# Altium project Fri3D_2020_00.PrjPcb
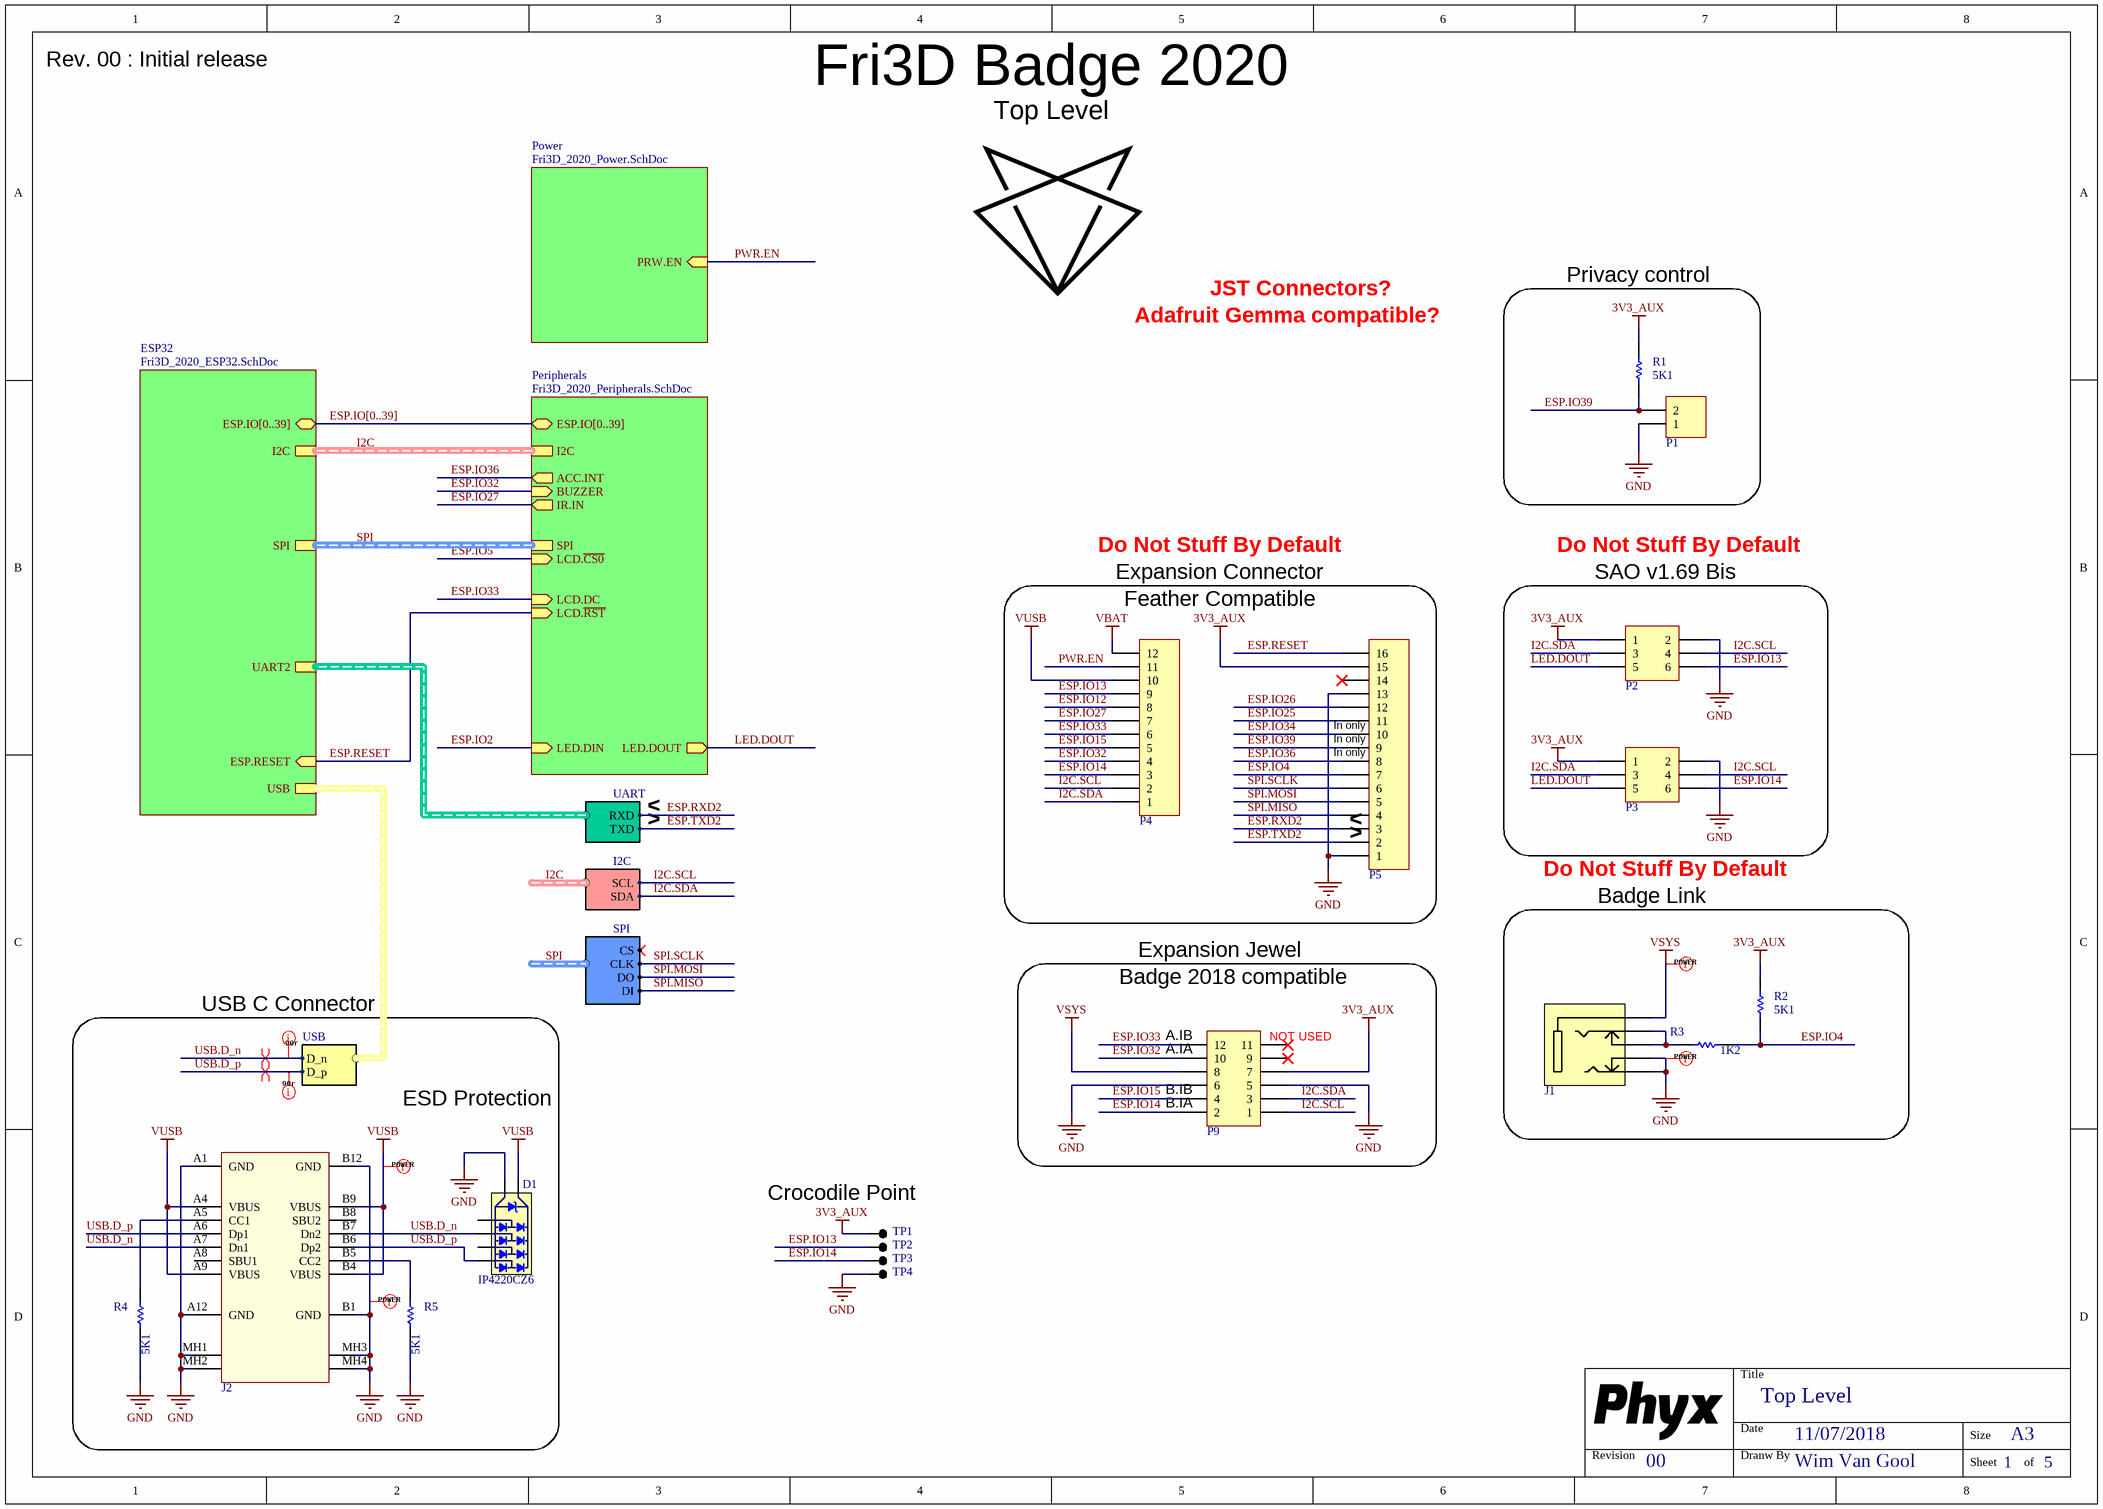
[diagram p0: Fri3D_2020_00.SchDoc]
PCB_ENGINEER: WimVG; PCB_REV: 00; PCB_TITLE: Fri3D Badge 2020
4 sheets, 115 parts. Net scope: hierarchical (ports join the sheet entries above them; power ports are global).
Board file: Fri3D_2020_00.PcbDoc
Sheets:
  Fri3D_2020_00.SchDoc
    Peripherals = Fri3D_2020_Peripherals.SchDoc
    Power = Fri3D_2020_Power.SchDoc
    ESP32 = Fri3D_2020_ESP32.SchDoc

## Sheet Fri3D_2020_00.SchDoc: Top Level
size A3; Date: 11/07/2018; DrawnBy: Wim Van Gool; DocumentNumber: 1; Revision: 00; SheetNumber: 1; SheetTotal: 5

### Parts
D1  value IP4220CZ6  [NXP_SOT457]  (hidden comment: TVS Diode Dual USB)
J1  3.5mm jack, dual switch, black, 3 contacts  [CUI_SJ1-3525NG]  (value not drawn)
J2  USB 2.0 C Reversible Receptacle Horizontal  [HRO_TYPE-C-31-M-12]  (value not drawn)
P1  Easy to solder connection  [SOLDER_SW_V_1MM]  (value not drawn)
P2  Receptacle 3x2  [RCPT2X3]  (value not drawn)
P3  Receptacle 3x2  [RCPT2X3]  (value not drawn)
P4  Header 12  [HDR1X12]  (value not drawn)
P5  Header 16  [HDR1X16]  (value not drawn)
P9  Receptacle 6x2 SMD low profile  [WE_610312243021_POST]  (value not drawn)
R1  value 5K1  [R0603_N]  (hidden comment: RESISTOR)
R2  value 5K1  [R0603_N]  (hidden comment: RESISTOR)
R3  value 1K2  [R0603_N]  (hidden comment: RESISTOR)
R4  value 5K1  [R0603_N]  (hidden comment: RESISTOR)
R5  value 5K1  [R0603_N]  (hidden comment: RESISTOR)
TP1  TEST_PAD  [TP_0.8mm]  (value not drawn)
TP2  TEST_PAD  [TP_0.8mm]  (value not drawn)
TP3  TEST_PAD  [TP_0.8mm]  (value not drawn)
TP4  TEST_PAD  [TP_0.8mm]  (value not drawn)

### Blocks framed on the sheet
Privacy control: P1 R1
SAO v1.69 Bis: P2 P3
Badge Link: J1 R2 R3

### Sub-sheets
ESP32 = Fri3D_2020_ESP32.SchDoc: I2C (harness I2C), USB (harness USB), SPI (harness SPI), UART2 (harness UART), ESP.RESET (in), ESP.IO[0..39] (bidir)
Peripherals = Fri3D_2020_Peripherals.SchDoc: I2C (harness I2C), ACC.INT (out), BUZZER (in), LED.DIN (in), LED.DOUT (out), SPI (harness SPI), IR.IN (out), LCD.DC (in), LCD.~{RST} (in), LCD.~{CS0} (in), ESP.IO[0..39] (bidir)
Power = Fri3D_2020_Power.SchDoc: PRW.EN (in)

### Harnesses
USB: D_p, D_n
I2C: SDA, SCL
SPI: CS, CLK, DO, DI
UART: TXD, RXD

### Nets
3V3_AUX: P2.1 P3.1 P5.15 P9.7 R1.1 R2.1 TP1.1
GND: D1.2(GND) J1.2(Tip) J1.4 J2.A1(GND) J2.A12(GND) J2.B1(GND) J2.B12(GND) J2.MH1(Tab) J2.MH2(Tab) J2.MH3(Tab) J2.MH4(Tab) P1.1 P2.2 P3.2 P5.1 P5.13 P9.5 P9.6 R4.2 R5.2 TP4.1
VBAT: P4.12
VSYS: J1.1(Sleeve) P9.8
VUSB: D1.5(VBus) J2.A4(VBUS) J2.A9(VBUS) J2.B4(VBUS) J2.B9(VBUS) P4.10
ESP.IO4: P5.7 R2.2 R3.1
ESP.IO12: P4.8
ESP.IO13: P2.6 P4.9 TP2.1
ESP.IO14: P3.6 P4.3 P9.2 TP3.1
ESP.IO15: P4.5 P9.4
ESP.IO25: P5.11
ESP.IO26: P5.12
ESP.IO27: P4.7 ; sheet Peripherals/IR.IN
ESP.IO32: P4.4 P9.10 ; sheet Peripherals/BUZZER  [project net BUZZER]
ESP.IO33: P4.6 P9.12 ; sheet Peripherals/LCD.DC
ESP.IO34: P5.10
ESP.IO36: P5.8 ; sheet Peripherals/ACC.INT  [project net ACC.INT1]
ESP.IO39: P1.2 P5.9 R1.2
ESP.RESET: P5.16 ; sheet Peripherals/LCD.~{RST}, sheet ESP32/ESP.RESET
ESP.RXD2: P5.3 ; sheet ESP32/UART2.RXD  [project net ESP.IO16]
ESP.TXD2: P5.2 ; sheet ESP32/UART2.TXD  [project net ESP.IO17]
I2C.SCL: P2.4 P3.4 P4.2 P9.1 ; sheet Peripherals/I2C.SCL
I2C.SDA: P2.3 P3.3 P4.1 P9.3 ; sheet Peripherals/I2C.SDA
LED.DOUT: P2.5 P3.5 ; sheet Peripherals/LED.DOUT
PWR.EN: P4.11 ; sheet Power/PRW.EN
SPI.MISO: P5.4 ; sheet Peripherals/SPI.DI  [project net SPI.DI]
SPI.MOSI: P5.5 ; sheet Peripherals/SPI.DO  [project net SPI.DO]
SPI.SCLK: P5.6 ; sheet Peripherals/SPI.CLK  [project net SPI.CLK]
USB.D_n: D1.1 J2.A7(Dn1) J2.B7(Dn2) ; sheet ESP32/USB.D_n
USB.D_p: D1.6 J2.A6(Dp1) J2.B6(Dp2) ; sheet ESP32/USB.D_p
NetJ1_3: J1.3(Ring) J1.5 R3.2
NetJ2_A5: J2.A5(CC1) R4.1
NetJ2_B5: J2.B5(CC2) R5.1

Not connected (* = marked no-connect by the designer): D1 3 4; J2 A8(SBU1) B8(SBU2); P5 14*; P9 9* 11*

### Buses and harness runs
bus ESP.IO[0..39] = sheet ESP32/ESP.IO[0..39] = sheet Peripherals/ESP.IO[0..39]
harness I2C = sheet ESP32/I2C = sheet Peripherals/I2C
harness SPI = sheet ESP32/SPI = sheet Peripherals/SPI

### Layout directives
net class 90r: USB.D_n, USB.D_p
differential pair: USB.D_n, USB.D_p
net class POWER: GND, VSYS, VUSB

### Notes on the sheet
- Rev. 00 : Initial release
- JST Connectors?
- Adafruit Gemma compatible?
- Expansion Connector
- Do Not Stuff By Default
- Feather Compatible
- (near P5) In only
- >
- <
- (near P5) >
- (near P5) <
- Expansion Jewel
- Badge 2018 compatible
- USB C Connector
- (near P9) A.IB
- (near P9) A.IA
- (near P9) NOT USED
- ESD Protection
- (near P9) B.IB
- (near P9) B.IA
- Crocodile Point
- Title
- Revision
- Date
- Dranw By
- Size
- A3
- Sheet
- of

### Library data of the parts
D1 = TVS # IP4220CZ6 Dual USB: =Description; Supplier 1: Farnell; Supplier Part Number 1: 2143248
J1 = AUDIO JACK 3.5 3c SJ1-3525NG: =Description; Value: SJ1-3525NG; Supplier 1: Digi-key; Supplier Part Number 1: CP1-3525NG-ND
J2 = USB # C 2.0 RCPT TYPE-C-31-M-12: Value: TYPE-C-31-M-12; Supplier 1: China; Supplier Part Number 1: HRO TYPE-C-31-M-12; Supplier 2: LCSC; Supplier Part Number 2: C165948; Supplier 3: LCSC ALT; Supplier Part Number 3: C167321 / C319148
P1 = SOLDER SW V 1MM: Value: NO BOM
P2 P3 = Receptacle 2.54mm dual row 6way
P4 = Pin Header 2.54mm 12way
P5 = Pin Header 2.54mm 16way
P9 = Receptacle # 2.54mm dual row 12way 610312243021: Value: 610312243021; Supplier 1: Wurth; Supplier Part Number 1: 610312243021
R1 R2 R4 R5 = RES # 5K1 0603: Supplier 1: Farnell; Supplier Part Number 1: 2845922
R3 = RES # 1K2 0603
TP1-TP4 = TP # 0.8mm: Value: NO BOM

## Sheet Fri3D_2020_Peripherals.SchDoc: Peripherals
size A3; Date: 11/07/2018; DrawnBy: Wim Van Gool; DocumentNumber: 4; Revision: 00; SheetNumber: 4; SheetTotal: 5
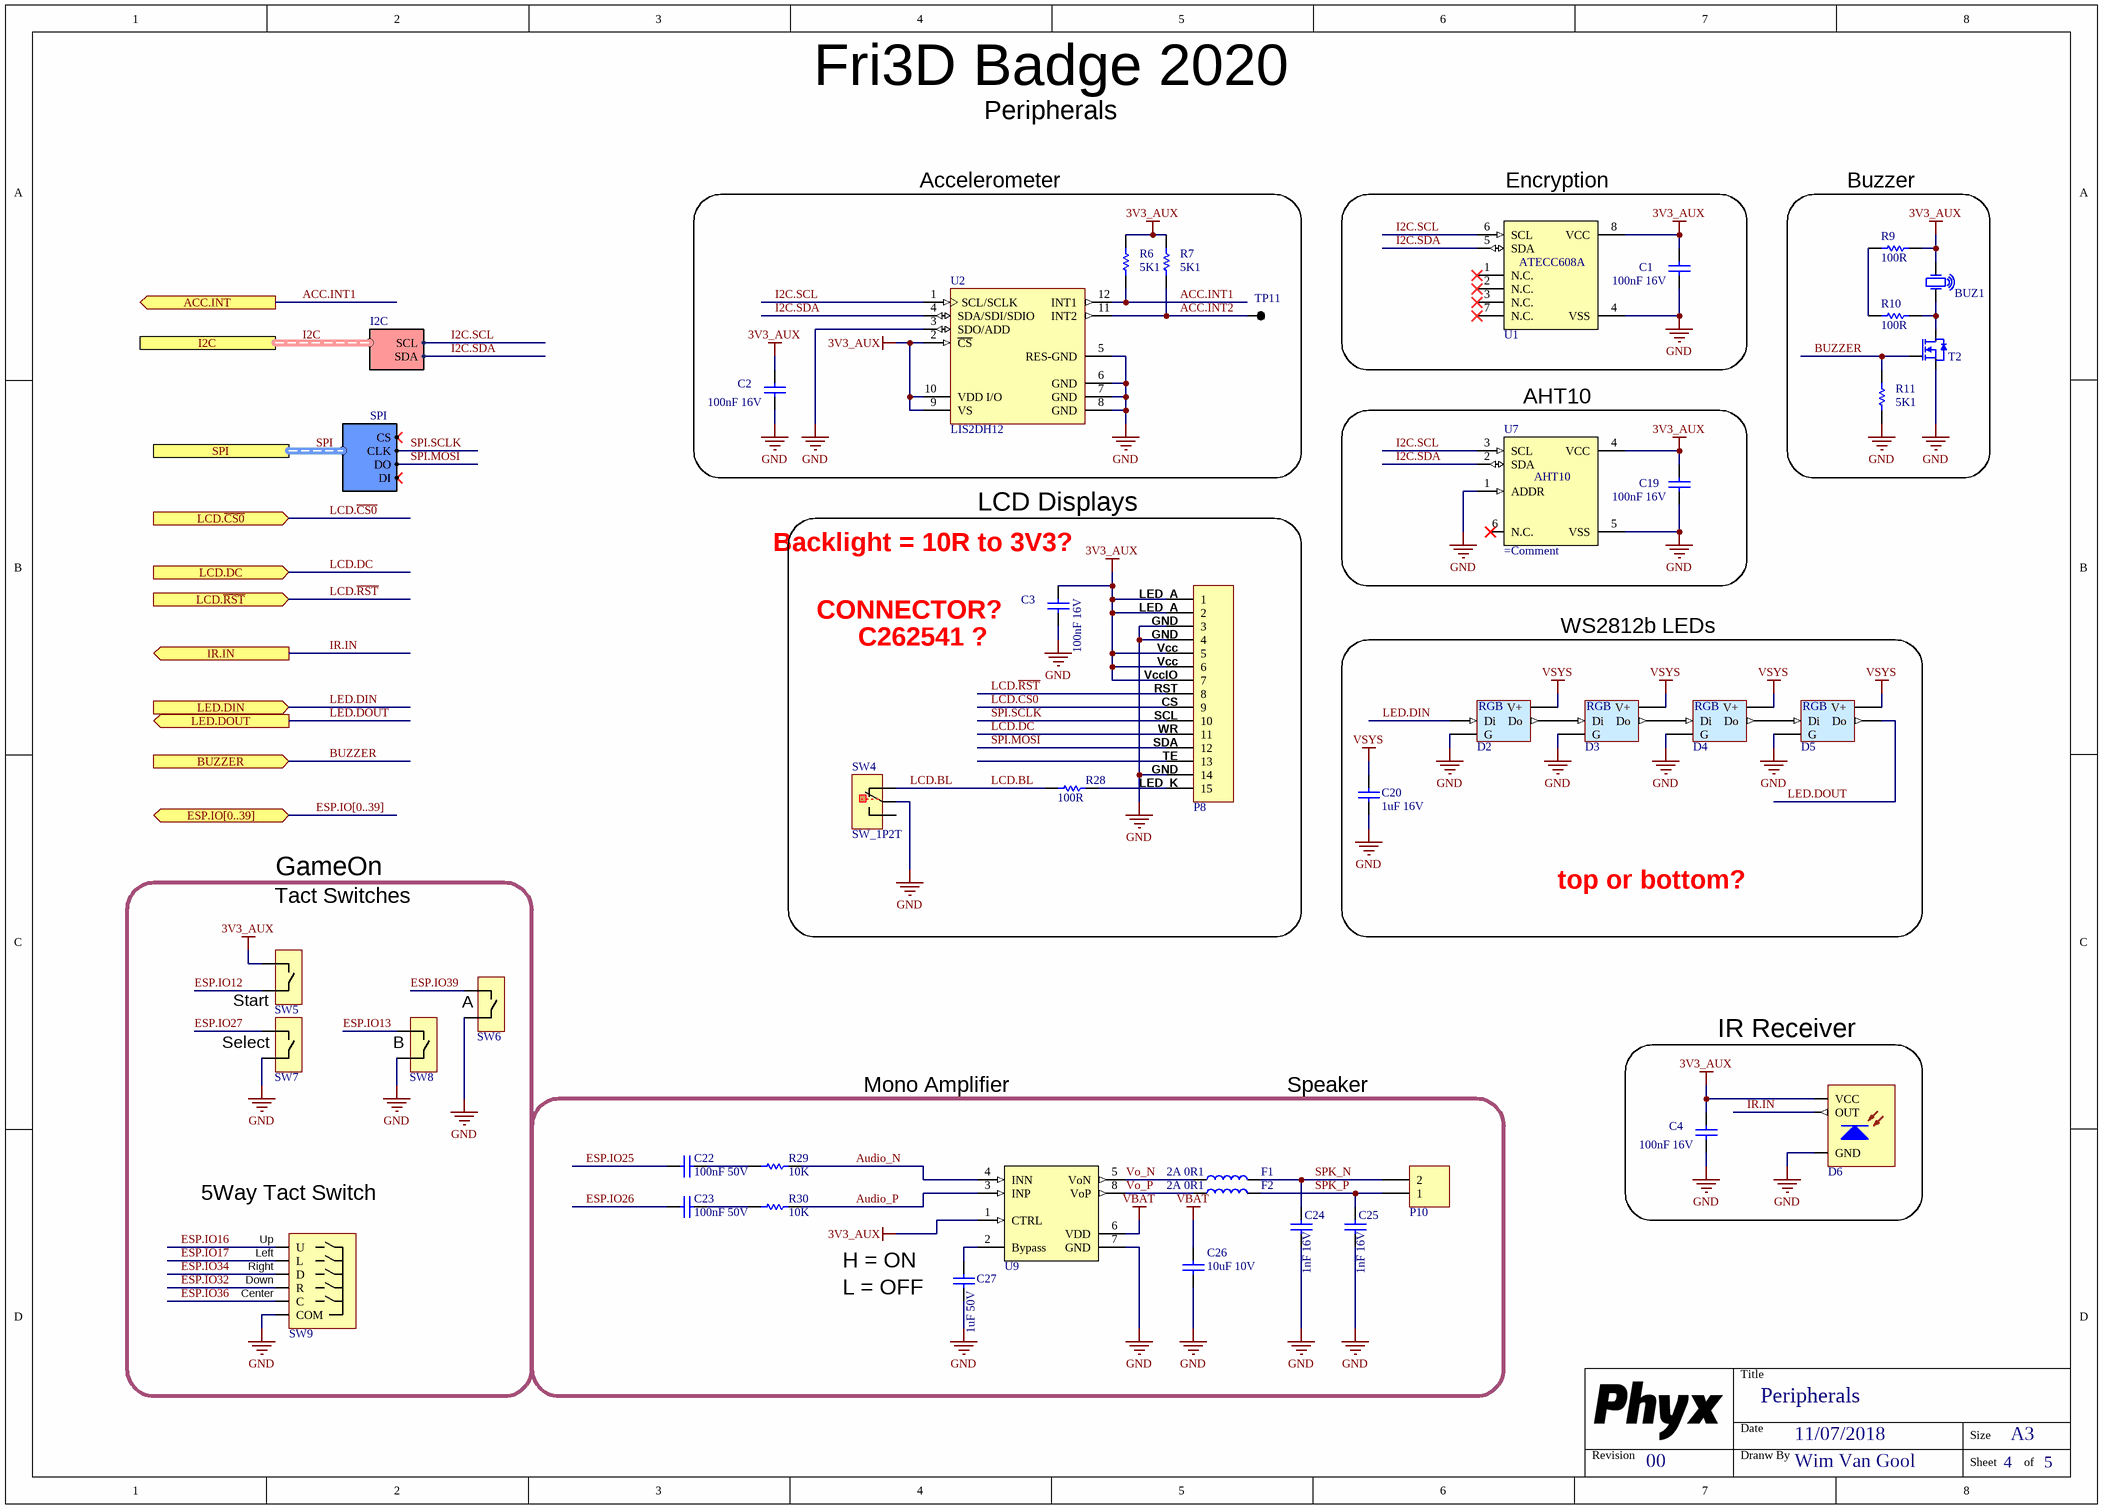
[diagram p1: Fri3D_2020_Peripherals.SchDoc]

### Parts
BUZ1  12x12x3mm Piezo Buzzer Transducer 81dB  [CUI_CMT-1203-SMT]  (value not drawn)
C1  value 100nF 16V  [C0603_N]
C2  value 100nF 16V  [C0603_N]
C3  value 100nF 16V  [C0603_N]
C4  value 100nF 16V  [C0603_N]
C19  value 100nF 16V  [C0603_N]
C20  value 1uF 16V  [C0603_N]  (hidden comment: CAP_CERAMIC)
C22  value 100nF 50V  [C0603_N]  (hidden comment: CAP_CERAMIC)
C23  value 100nF 50V  [C0603_N]  (hidden comment: CAP_CERAMIC)
C24  value 1nF 16V  [C0603_N]  (hidden comment: CAP_CERAMIC)
C25  value 1nF 16V  [C0603_N]  (hidden comment: CAP_CERAMIC)
C26  value 10uF 10V  [C0805_N]  (hidden comment: CAP_CERAMIC)
C27  value 1uF 50V  [C0603_N]  (hidden comment: CAP_CERAMIC)
D2  WS2812 based digital RGB LED 5050 Black package  [LED_5050_WS2812B_BLACK]  (value not drawn)
D3  WS2812 based digital RGB LED 5050 Black package  [LED_5050_WS2812B_BLACK]  (value not drawn)
D4  WS2812 based digital RGB LED 5050 Black package  [LED_5050_WS2812B_BLACK]  (value not drawn)
D5  WS2812 based digital RGB LED 5050 Black package  [LED_5050_WS2812B_BLACK]  (value not drawn)
D6  IRM-3638N3F14 Infrared Receiver 38 kHz 45° 2.7-5.5V  [VIS_TSOP381x_BENT]  (value not drawn)
F1  value 2A 0R1  [L0805]  (hidden comment: FERRITE)
F2  value 2A 0R1  [L0805]  (hidden comment: FERRITE)
P8  Bottom contact FPC 0.3mm pitch 15 contacts  [FPC_AFE03-S15FMA-1H]  (value not drawn)
P10  Header 2  [HDR1X2]  (value not drawn)
R6  value 5K1  [R0603_N]  (hidden comment: RESISTOR)
R7  value 5K1  [R0603_N]  (hidden comment: RESISTOR)
R9  value 100R  [R0603_N]  (hidden comment: RESISTOR)
R10  value 100R  [R0603_N]  (hidden comment: RESISTOR)
R11  value 5K1  [R0603_N]  (hidden comment: RESISTOR)
R28  value 100R  [R0603_N]  (hidden comment: RESISTOR)
R29  value 10K  [R0603_N]  (hidden comment: RESISTOR)
R30  value 10K  [R0603_N]  (hidden comment: RESISTOR)
SW4  SW_1P2T  [WE_450404015514]
SW5  Default TH TACT  [TACTSW]  (value not drawn)
SW6  Default TH TACT  [TACTSW]  (value not drawn)
SW7  Default TH TACT  [TACTSW]  (value not drawn)
SW8  Default TH TACT  [TACTSW]  (value not drawn)
SW9  5Way Tact switch  [TACTSW_5W_K1-1506DN-01]  (value not drawn)
T2  0.2A N-Ch MOSFET Vgs 3.2  [SOT23-3]  (value not drawn)
TP11  TEST_PAD  [TP_0.8mm]  (value not drawn)
U1  Encryption Authentication with 72b SN, SHA-256, AES-128  [SOIC_N_8]  (value not drawn)
U2  LIS2DH12  [STM_LGA12_2x2]
U7  (no value)  [AHT10]
U9  5W Class D mono amplifier inducter-less Differential input MSOP8  [MAX_uSOP8]  (value not drawn)

### Blocks framed on the sheet
Accelerometer: C2 R6 R7 TP11 U2
Encryption: C1 U1
Buzzer: BUZ1 R9-R11 T2
AHT10: C19 U7
top or bottom?: C20 D2-D5
GameOn: SW5-SW9
IR Receiver: C4 D6

### Ports
ACC.INT (out), BUZZER (in), ESP.IO[0..39] (bidir), I2C (harness I2C), IR.IN (out), LCD.DC (in), LCD.~{CS0} (in), LCD.~{RST} (in), LED.DIN (in), LED.DOUT (out), SPI (harness SPI)

### Harnesses
I2C: SDA, SCL
SPI: CS, CLK, DO, DI

### Nets
3V3_AUX: BUZ1.1(OSC1) C1.1 C2.1 C3.1 C4.1 C19.1 D6.3(VCC) P8.1 P8.2 P8.5 P8.6 P8.7 R6.1 R7.1 R9.1 SW5.1 U1.8(VCC) U2.2(~{CS}) U2.9(VS) U2.10(VDD_I/O) U7.4(VCC) U9.1(CTRL)
GND: C1.2 C2.2 C3.2 C4.2 C19.2 C20.2 C24.2 C25.2 C26.2 C27.2 D2.3(G) D3.3(G) D4.3(G) D5.3(G) D6.2(GND) P8.3 P8.4 P8.14 R11.2 SW4.2 SW6.2 SW7.2 SW8.2 SW9.4(COM) T2.2(S) U1.4(VSS) U2.3(SDO/ADD) U2.5(RES-GND) U2.6(GND) U2.7(GND) U2.8(GND) U7.1(ADDR) U7.5(VSS) U9.7(GND)
VBAT: C26.1 U9.6(VDD)
VSYS: C20.1 D2.1(V+) D3.1(V+) D4.1(V+) D5.1(V+)
ACC.INT1: R6.2 SW9.6(C) U2.12(INT1) ; port ACC.INT  [also labelled ESP.IO36]
ACC.INT2: R7.2 TP11.1 U2.11(INT2)
Audio_N: R29.2 U9.4(INN)
Audio_P: R30.2 U9.3(INP)
BUZZER: R11.1 SW9.5(R) T2.1(G) ; port BUZZER  [also labelled ESP.IO32]
ESP.IO12: SW5.2
ESP.IO13: SW8.1
ESP.IO16: SW9.1(U)
ESP.IO17: SW9.2(L)
ESP.IO25: C22.2
ESP.IO26: C23.2
ESP.IO27: D6.1(OUT) SW7.1 ; port IR.IN  [also labelled IR.IN]
ESP.IO34: SW9.3(D)
ESP.IO39: SW6.1
I2C.SCL: U1.6(SCL) U2.1(SCL/SCLK) U7.3(SCL) ; port I2C.SCL
I2C.SDA: U1.5(SDA) U2.4(SDA/SDI/SDIO) U7.2(SDA) ; port I2C.SDA
LCD.BL: R28.2 SW4.1
LCD.~{CS0}: P8.9 ; port LCD.~{CS0}  [project net ESP.IO5]
LCD.DC: P8.11 ; port LCD.DC  [project net ESP.IO33]
LCD.~{RST}: P8.8 ; port LCD.~{RST}  [project net ESP.RESET]
LED.DIN: D2.4(Di) ; port LED.DIN  [project net ESP.IO2]
LED.DOUT: D5.2(Do) ; port LED.DOUT
SPI.MOSI: P8.12 ; port SPI.DO  [project net SPI.DO]
SPI.SCLK: P8.10 ; port SPI.CLK  [project net SPI.CLK]
SPK_N: C24.1 F1.2 P10.2
SPK_P: C25.1 F2.2 P10.1
Vo_N: F1.1 U9.5(VoN)
Vo_P: F2.1 U9.8(VoP)
NetBUZ1_2: BUZ1.2(OSC2) R10.1 T2.3(D)
NetC22_1: C22.1 R29.1
NetC23_1: C23.1 R30.1
NetC27_1: C27.1 U9.2(Bypass)
NetD2_2: D2.2(Do) D3.4(Di)
NetD3_2: D3.2(Do) D4.4(Di)
NetD4_2: D4.2(Do) D5.4(Di)
NetP8_15: P8.15 R28.1
NetR9_2: R9.2 R10.2

Not connected (* = marked no-connect by the designer): P8 13; SW4 3; U1 1(N.C.)* 2(N.C.)* 3(N.C.)* 7(N.C.)*; U7 6(N.C.)*

### Buses and harness runs
bus ESP.IO[0..39] = port ESP.IO[0..39]
harness I2C = port I2C
harness SPI = port SPI

### Notes on the sheet
- LCD Displays
- (near C3) Backlight = 10R to 3V3?
- (near P8) LED_A
- CONNECTOR?
- C262541 ?
- (near P8) GND
- (near P8) Vcc
- WS2812b LEDs
- (near P8) VccIO
- (near P8) RST
- (near P8) CS
- (near P8) SCL
- (near P8) WR
- (near P8) SDA
- (near P8) TE
- (near P8) LED_K
- Tact Switches
- (near SW5) Start
- (near SW7) Select
- (near SW8) B
- (near SW6) A
- Mono Amplifier
- Speaker
- (near SW9) Up
- (near SW9) Left
- (near SW9) 5Way Tact Switch
- (near SW9) Right
- (near SW9) Down
- (near SW9) Center
- H = ON
- (near C27) L = OFF
- Title
- Revision
- Date
- Dranw By
- Size
- A3
- Sheet
- of
- (in symbol CRYPTO # ATECC608A I2C SOIC-8) ATECC608A
- (in symbol LED # RGB WS2812B-5050 BL) RGB

### Library data of the parts
BUZ1 = BUZ # CUI CMT-1203-SMT: Crystal Oscillator; Value: CMT-1203-SMT; Supplier 1: Digikey; Supplier Part Number 1: 102-2197-1-ND; Supplier 2: Aliexpress; Supplier Part Number 2: KLJ-1230
C1-C4 C19 = CAP # 100nF 16V 0603: Capacitor Ceramic
C20 = CAP # 1uF 16V 0603: Capacitor Ceramic; Supplier 1: Farnell; Supplier Part Number 1: 2320814
C22 C23 = CAP # 100nF 50V 0603: Capacitor Ceramic; Supplier 1: Farnell; Supplier Part Number 1: 1759122
C24 C25 = CAP # 1nF 16V 0603: Capacitor Ceramic
C26 = CAP # 10uF 10V 0805: Capacitor Ceramic; Supplier 1: Farnell; Supplier Part Number 1: 2320859
C27 = CAP # 1uF 50V 0603: Capacitor Ceramic; Supplier 1: Farnell; Supplier Part Number 1: 2112858
D2-D5 = LED # RGB WS2812B-5050 BL: =Description; Value: WS218B 5050 BL; Supplier 1: Aliexpress; Supplier Part Number 1: WS2812B Black 5050
D6 = PHO IR Rx RA: =Description; Value: IRM-3638N3F14; Supplier 1: LCSC; Supplier Part Number 1: C264262
F1 F2 = FER # 600R 2A 0805 0R10: Supplier 1: Farnell; Supplier Part Number 1: 1838838
P8 = FPC # 15 Bottom 0.3mm AFE03-S15FMA-1H: Value: AFE03-S15FMA-1H; Supplier 1: LCSC; Supplier Part Number 1: C262541
P10 = Pin Header 2.54mm 2way
R6 R7 R11 = RES # 5K1 0603: Supplier 1: Farnell; Supplier Part Number 1: 2845922
R9 R10 R28 = RES # 100R 0603
R29 R30 = RES # 10K 0603: Supplier 1: Farnell; Supplier Part Number 1: 2502397
SW4 = SW # 1P2T WS-SLSU mini slide 6,7 x 2,7 mm
SW5-SW8 = SW TACT
SW9 = SW TACT 5W K1-1506DN-01: Value: K1-1506DN-01; Supplier 1: LCSC; Supplier Part Number 1: C145911
T2 = BSS138 N-Ch MOSFET 0.2A 3.2Vgs 60Vds: Value: BSS138; Supplier 1: Farnell; Supplier Part Number 1: 2432717
TP11 = TP # 0.8mm: Value: NO BOM
U1 = CRYPTO # ATECC608A I2C SOIC-8: =Description; Value: ATECC608A-SSHDA-T; Supplier 1: Farnell; Supplier Part Number 1: 2920872; Supplier 2: Digi-key; Supplier Part Number 2: ATECC608A-SSHDA-TCT-ND; Supplier 3: Mouser; Supplier Part Number 3: 556-ATECC608ASSHDAT
U2 = ACCELERO # LIS2DH12: =Description
U7 = TMP HUM # AHT10: =Description
U9 = AMP # AUDIO NS4150B: =Description; Value: NS4150B; Supplier 1: LCSC; Supplier Part Number 1: C189961

## Sheet Fri3D_2020_Power.SchDoc: Power
size A3; Date: 11/07/2018; DrawnBy: Wim Van Gool; DocumentNumber: 5; Revision: 00; SheetNumber: 5; SheetTotal: 5
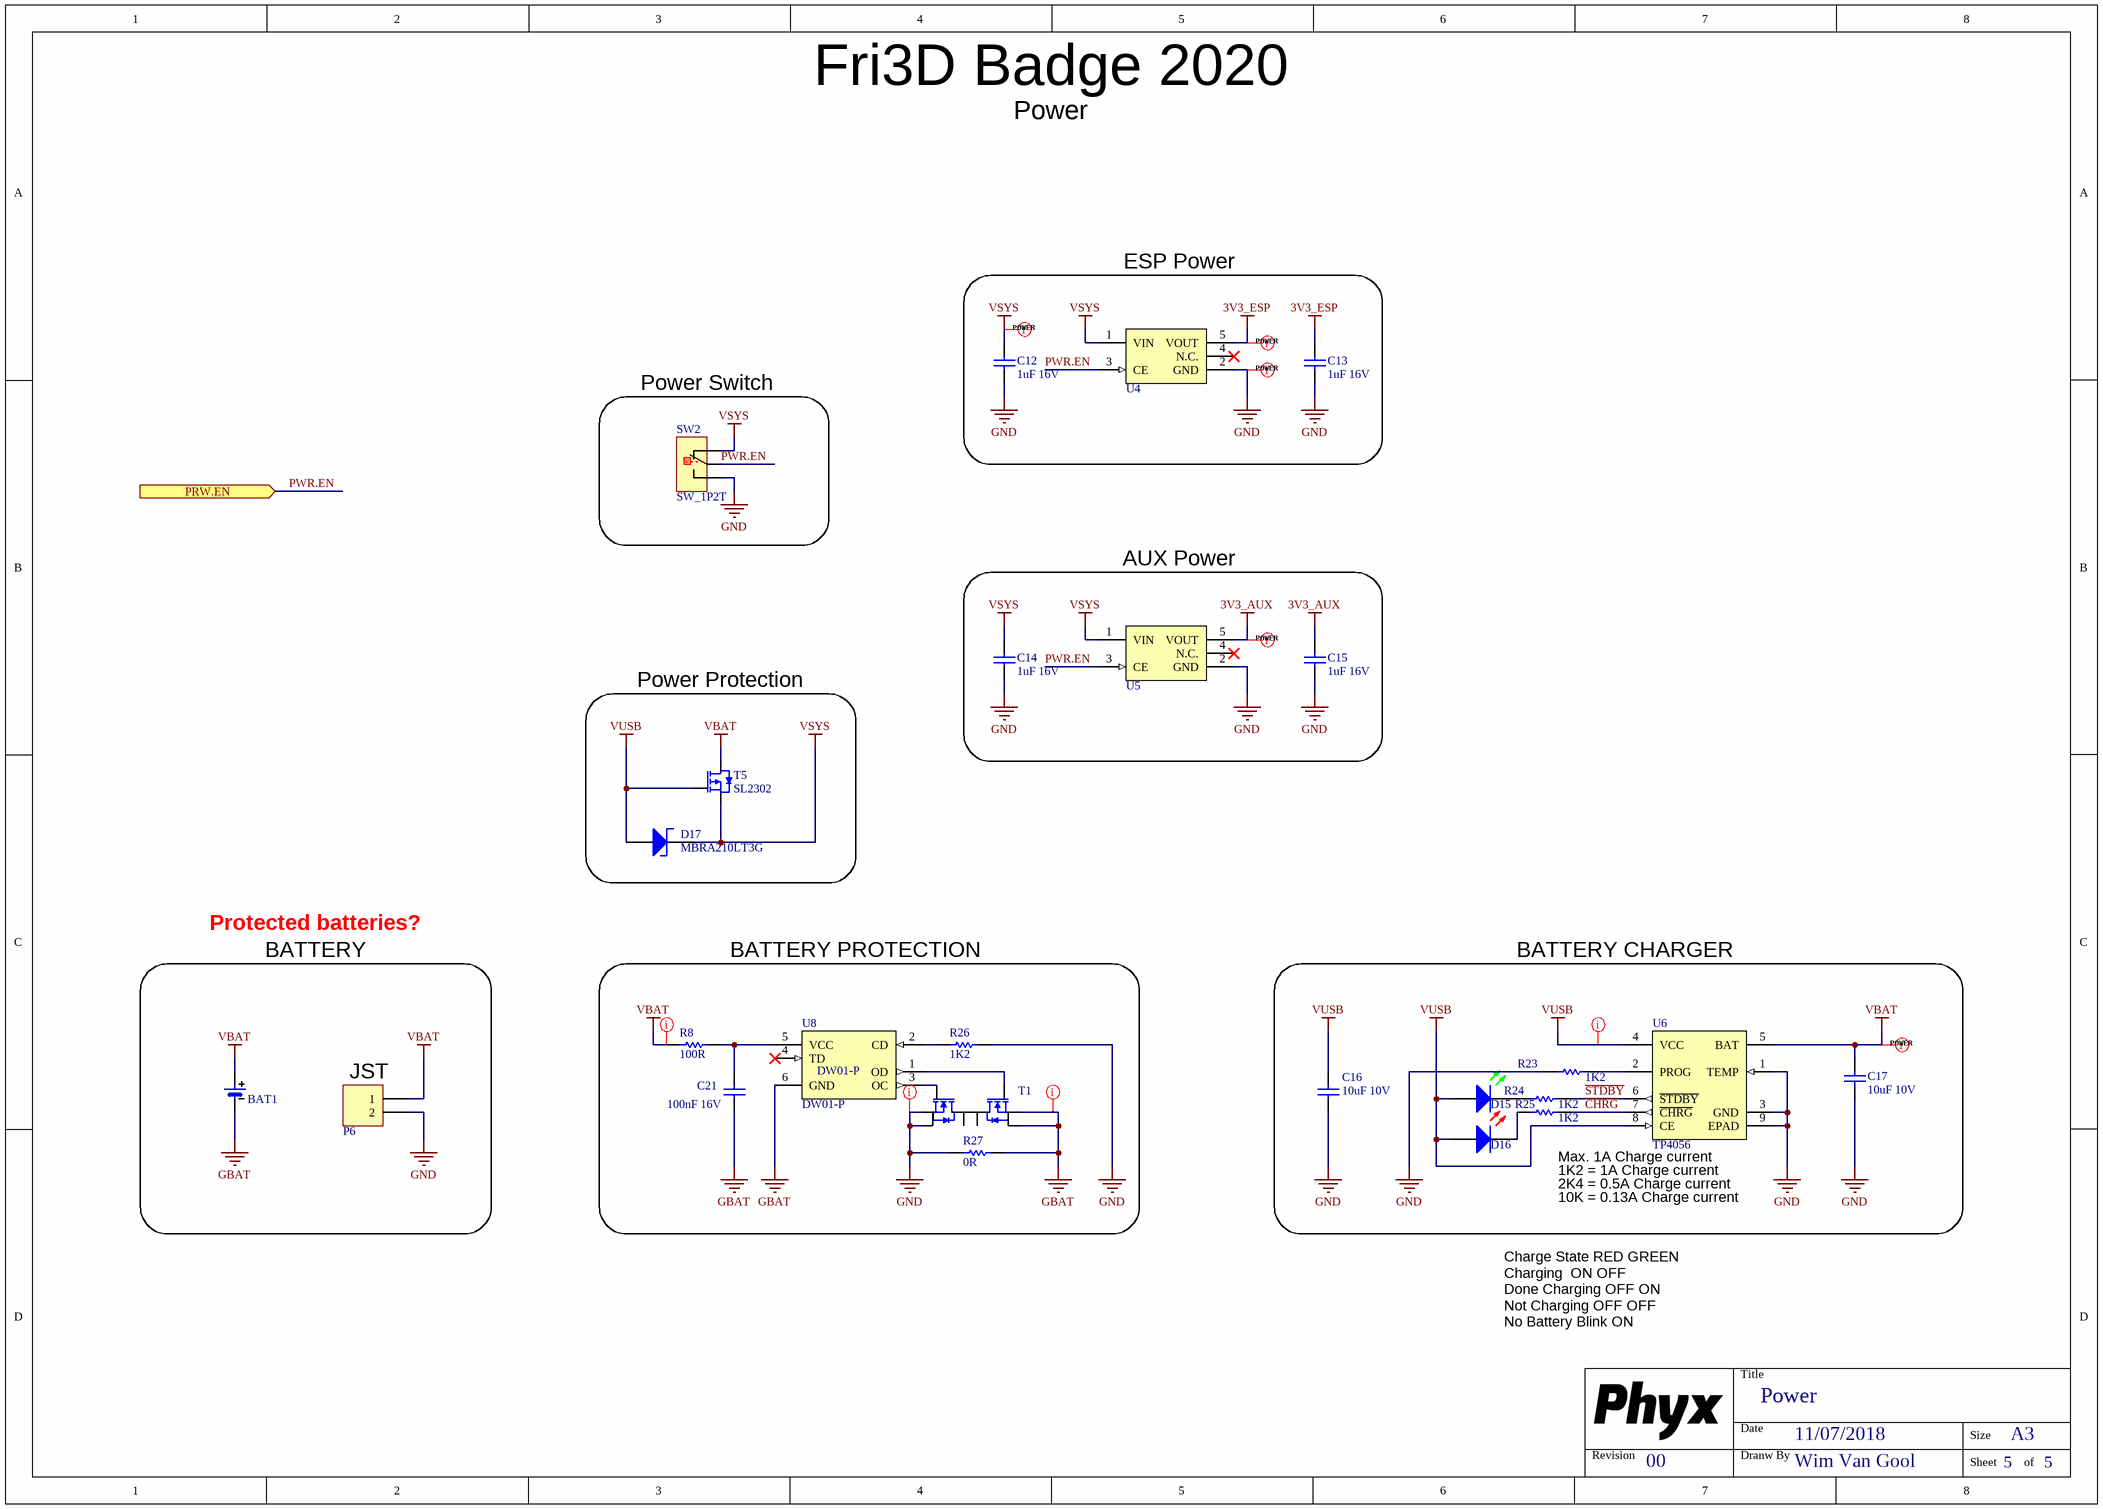
[diagram p2: Fri3D_2020_Power.SchDoc]

### Parts
BAT1  18650 Battery holder with spring  [BAT_18650_SPRING]  (value not drawn)
C12  value 1uF 16V  [C0603_N]  (hidden comment: CAP_CERAMIC)
C13  value 1uF 16V  [C0603_N]  (hidden comment: CAP_CERAMIC)
C14  value 1uF 16V  [C0603_N]  (hidden comment: CAP_CERAMIC)
C15  value 1uF 16V  [C0603_N]  (hidden comment: CAP_CERAMIC)
C16  value 10uF 10V  [C0805_N]  (hidden comment: CAP_CERAMIC)
C17  value 10uF 10V  [C0805_N]  (hidden comment: CAP_CERAMIC)
C21  value 100nF 16V  [C0603_N]
D15  Default 0805 Green LED  [LED_0805_GR]  (value not drawn)
D16  Default 0805 Red LED  [LED_0805_RD]  (value not drawn)
D17  MBRA210LT3G  [SMA_AC]
P6  Header 2.0mm Shrouded 2  [WE_620102131822]  (value not drawn)
R8  value 100R  [R0603_N]  (hidden comment: RESISTOR)
R23  value 1K2  [R0603_N]  (hidden comment: RESISTOR)
R24  value 1K2  [R0603_N]  (hidden comment: RESISTOR)
R25  value 1K2  [R0603_N]  (hidden comment: RESISTOR)
R26  value 1K2  [R0603_N]  (hidden comment: RESISTOR)
R27  value 0R  [R0603_N]
SW2  SW_1P2T  [WE_450404015514]
T1  Dual N-Ch MOSFET Common Drain  [TSSOP_8_65P]  (value not drawn)
T5  SL2302  [SOT23-3]
U4  3V3 LDO 700mA 50mV  [SOT23-5]  (value not drawn)
U5  3V3 LDO 700mA 50mV  [SOT23-5]  (value not drawn)
U6  value TP4056  [SOIC_N_8_TH]  (hidden comment: Single Cell LiIon charger max 1A)
U8  value DW01-P  [SOT23-6]  (hidden comment: DW01-P single cell lithium protection)

### Blocks framed on the sheet
ESP Power: C12 C13 U4
Power Switch: SW2
AUX Power: C14 C15 U5
Power Protection: D17 T5
BATTERY PROTECTION: C21 R8 R26 R27 T1 U8
BATTERY CHARGER: C16 C17 D15 D16 R23-R25 U6

### Ports
PRW.EN (in)

### Nets
3V3_AUX: C15.1 U5.5(VOUT)
3V3_ESP: C13.1 U4.5(VOUT)
GBAT: BAT1.2 C21.2 R27.1 T1.2(S1) T1.3(S1) U8.6(GND)
GND: C12.2 C13.2 C14.2 C15.2 C16.2 C17.2 P6.2 R23.2 R26.2 R27.2 SW2.3 T1.6(S2) T1.7(S2) U4.2(GND) U5.2(GND) U6.1(TEMP) U6.3(GND) U6.9(EPAD)
VBAT: BAT1.1 C17.1 P6.1 R8.1 T5.3(D) U6.5(BAT)
VSYS: C12.1 C14.1 D17.C SW2.1 T5.2(S) U4.1(VIN) U5.1(VIN)
VUSB: C16.1 D15.1(A) D16.1(A) D17.A T5.1(G) U6.4(VCC) U6.8(CE)
~{CHRG}: R25.2 U6.7(~{CHRG})
PWR.EN: SW2.2 U4.3(CE) U5.3(CE) ; port PRW.EN
~{STDBY}: R24.2 U6.6(~{STDBY})
NetC21_1: C21.1 R8.2 U8.5(VCC)
NetD15_2: D15.2(K) R24.1
NetD16_2: D16.2(K) R25.1
NetR23_1: R23.1 U6.2(PROG)
NetR26_1: R26.1 U8.2(CD)
NetT1_4: T1.4(G1) U8.1(OD)
NetT1_5: T1.5(G2) U8.3(OC)

Not connected (* = marked no-connect by the designer): T1 1(D1) 8(D2); U4 4(N.C.)*; U5 4(N.C.)*; U8 4(TD)*

### Layout directives
net class POWER: 3V3_AUX, 3V3_ESP, GBAT, GND, VBAT, VSYS, VUSB

### Notes on the sheet
- BATTERY
- Protected batteries?
- (near P6) JST
- 1K2 = 1A Charge current
- 2K4 = 0.5A Charge current
- Max. 1A Charge current
- 10K = 0.13A Charge current
- Charge State	RED	GREEN
  Charging		ON	OFF
  Done Charging	OFF	ON
  Not Charging	OFF	OFF
  No Battery	Blink	ON
- Title
- Revision
- Date
- Dranw By
- Size
- A3
- Sheet
- of

### Library data of the parts
BAT1 = 18650 Battery holder spring CN: =Description; Value: 18650_SPRING; Supplier 1: TaoBao; Supplier Part Number 1: 39761834568
C12-C15 = CAP # 1uF 16V 0603: Capacitor Ceramic; Supplier 1: Farnell; Supplier Part Number 1: 2320814
C16 C17 = CAP # 10uF 10V 0805: Capacitor Ceramic; Supplier 1: Farnell; Supplier Part Number 1: 2320859
C21 = CAP # 100nF 16V 0603: Capacitor Ceramic
D15 = LED # Green 0805: =Description; Supplier 1: Farnell; Supplier Part Number 1: 2099239
D16 = LED # Red 0805: =Description; Supplier 1: Farnell; Supplier Part Number 1: 2099236
D17 = Schottky # MBRA210LT3G: =Description
P6 = HDR # SHR 2.0mm 2way - 620102131822: Value: 620102131822; Supplier 1: Wurth
R8 = RES # 100R 0603
R23-R26 = RES # 1K2 0603
R27 = RES # 0R 0603: Supplier 1: Farnell; Supplier Part Number 1: 2447743
SW2 = SW # 1P2T WS-SLSU mini slide 6,7 x 2,7 mm
T1 = FS8205A Dual N-Ch common Drain for DW01-P: =Description; Value: FS8205A; Supplier 1: AliExpress; Supplier Part Number 1: FS8205A
T5 = SL2302 P-Ch MOSFET 4.1A 20Vds: =Description
U4 U5 = LDO # 3V3 XC6210B33: =Designator; Value: XC6210B332MR; Supplier 1: Farnell; Supplier Part Number 1: 1057803
U6 = CHG # TP4056 LiIon 1A: =Description; Supplier 1: Aliexpress; Supplier Part Number 1: TP4056
U8 = PWR # DW01-P Lithium protection: =Description; Supplier 1: Aliexpress; Supplier Part Number 1: DW01-P

## Sheet Fri3D_2020_ESP32.SchDoc: ESP32 Module
size A3; Date: 11/07/2018; DrawnBy: Wim Van Gool; DocumentNumber: 3; Revision: 00; SheetNumber: 3; SheetTotal: 5
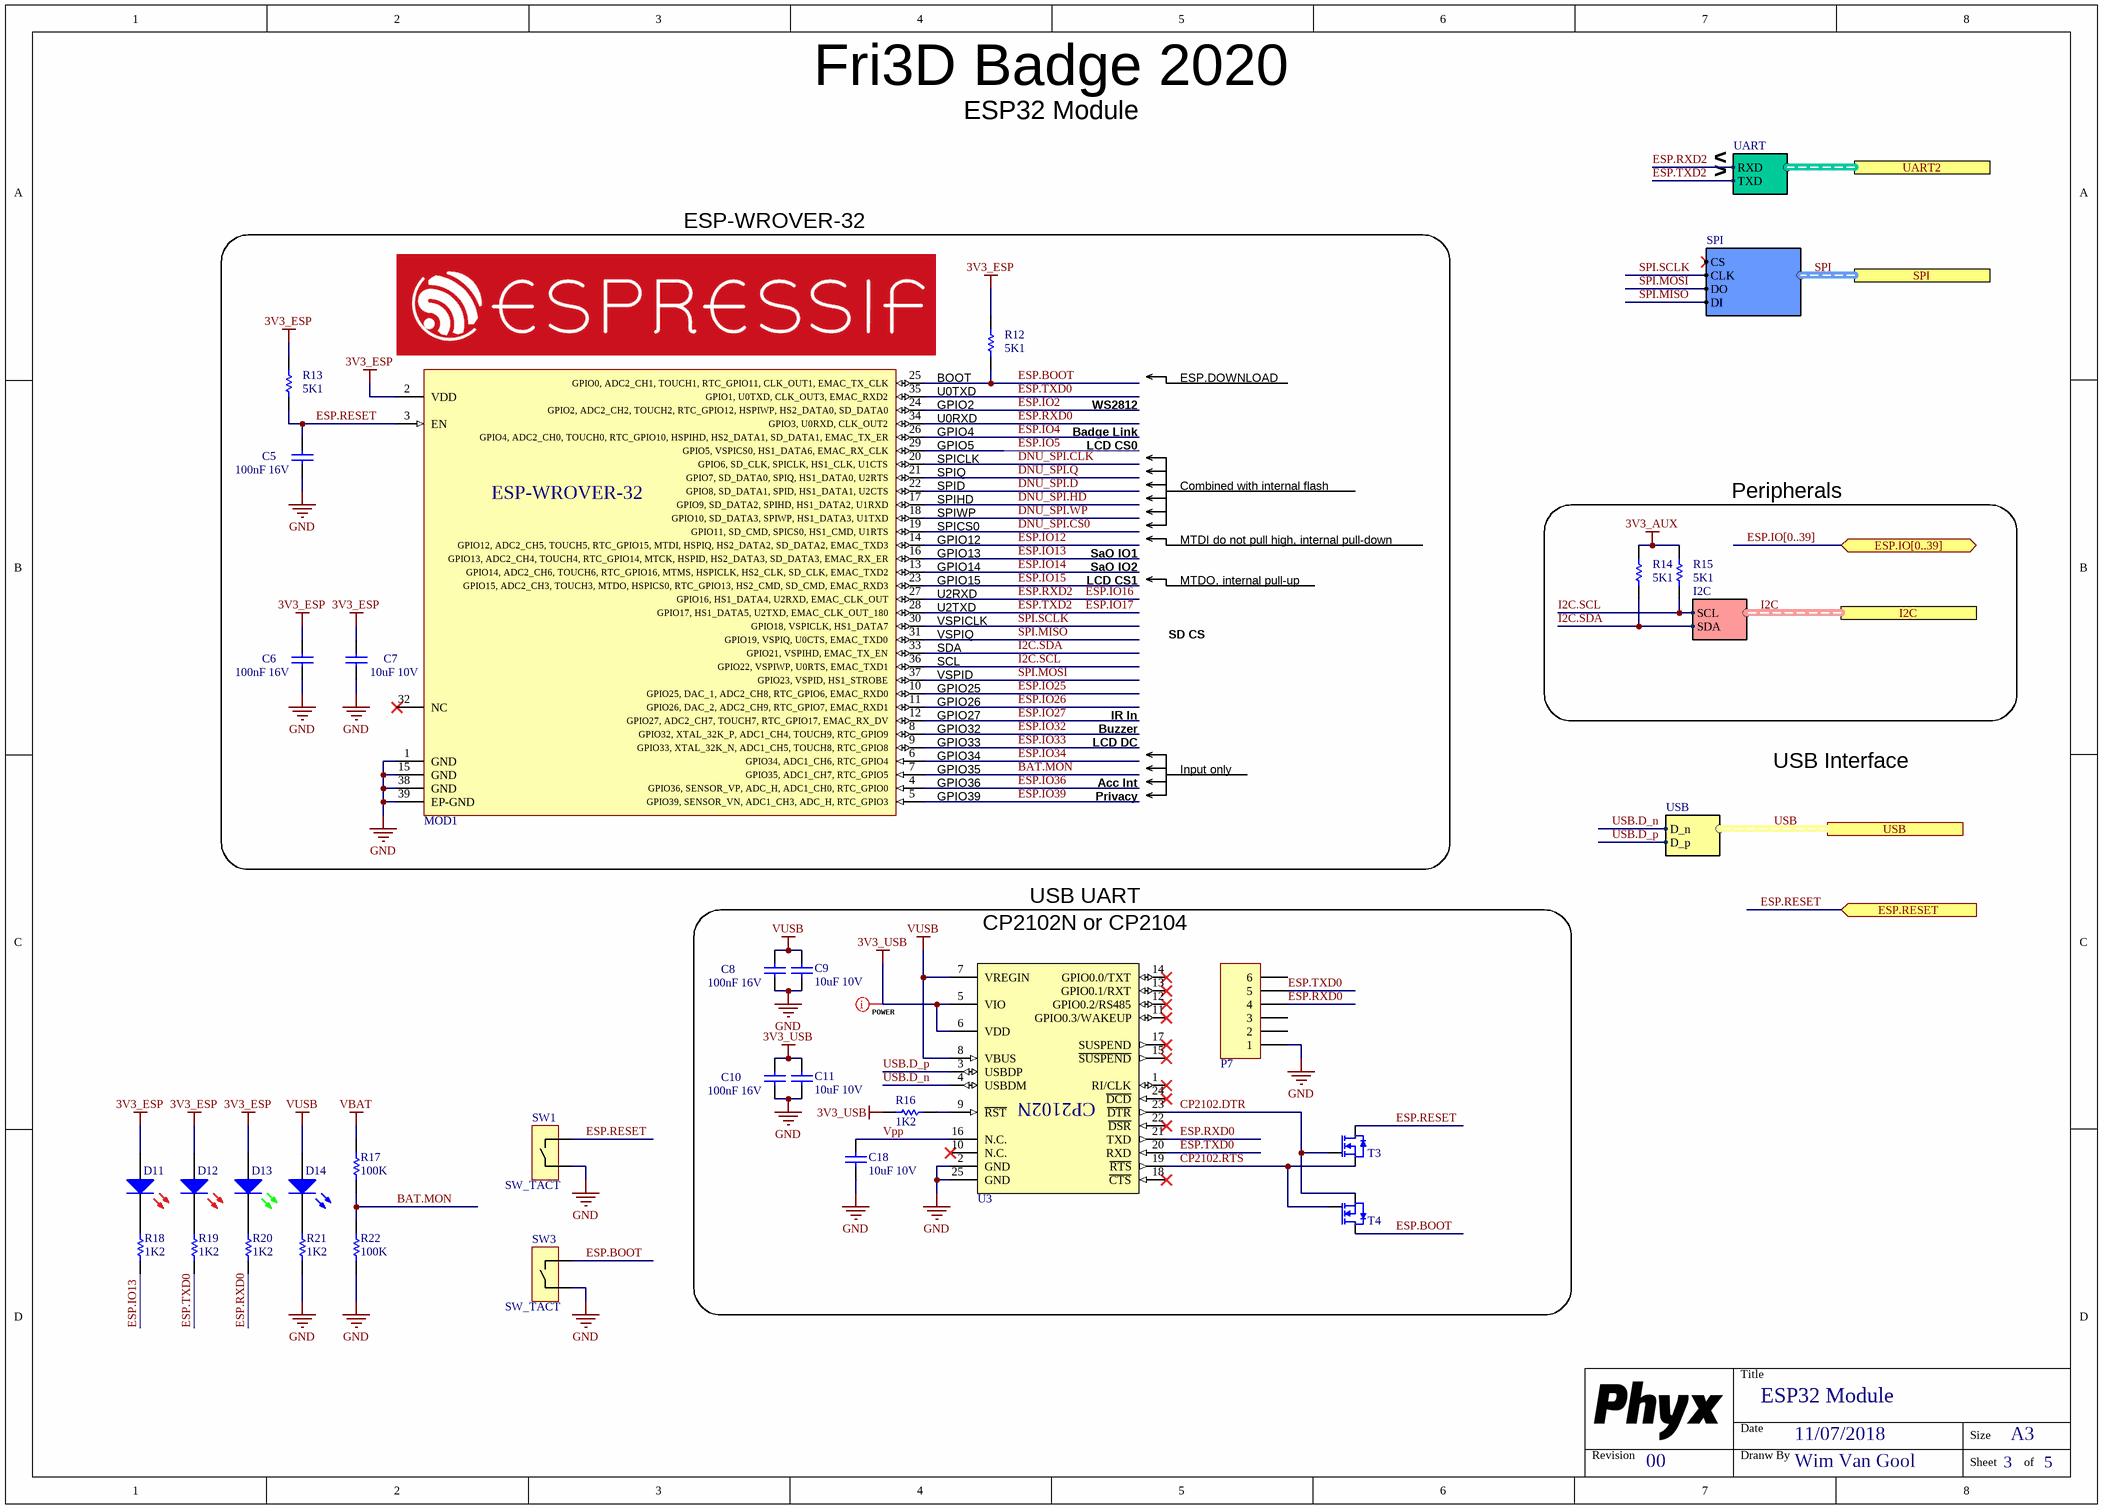
[diagram p3: Fri3D_2020_ESP32.SchDoc]

### Parts
C5  value 100nF 16V  [C0603_N]
C6  value 100nF 16V  [C0603_N]
C7  value 10uF 10V  [C0805_N]  (hidden comment: CAP_CERAMIC)
C8  value 100nF 16V  [C0603_N]
C9  value 10uF 10V  [C0805_N]  (hidden comment: CAP_CERAMIC)
C10  value 100nF 16V  [C0603_N]
C11  value 10uF 10V  [C0805_N]  (hidden comment: CAP_CERAMIC)
C18  value 10uF 10V  [C0805_N]  (hidden comment: CAP_CERAMIC)
D11  Default 0805 Red LED  [LED_0805_RD]  (value not drawn)
D12  Default 0805 Red LED  [LED_0805_RD]  (value not drawn)
D13  Default 0805 Green LED  [LED_0805_GR]  (value not drawn)
D14  Default 0805 Blue LED  [LED_0805_BL]  (value not drawn)
MOD1  ESP-32 based ESP-WROVER-32  [ESP-WROVER-32]  (value not drawn)
P7  Header 6  [HDR1X6]  (value not drawn)
R12  value 5K1  [R0603_N]  (hidden comment: RESISTOR)
R13  value 5K1  [R0603_N]  (hidden comment: RESISTOR)
R14  value 5K1  [R0603_N]  (hidden comment: RESISTOR)
R15  value 5K1  [R0603_N]  (hidden comment: RESISTOR)
R16  value 1K2  [R0603_N]  (hidden comment: RESISTOR)
R17  value 100K  [R0603_N]  (hidden comment: RESISTOR)
R18  value 1K2  [R0603_N]  (hidden comment: RESISTOR)
R19  value 1K2  [R0603_N]  (hidden comment: RESISTOR)
R20  value 1K2  [R0603_N]  (hidden comment: RESISTOR)
R21  value 1K2  [R0603_N]  (hidden comment: RESISTOR)
R22  value 100K  [R0603_N]  (hidden comment: RESISTOR)
SW1  SW_TACT  [WE_430181038816]
SW3  SW_TACT  [WE_430181038816]
T3  0.2A N-Ch MOSFET Vgs 3.2  [SOT23-3]  (value not drawn)
T4  0.2A N-Ch MOSFET Vgs 3.2  [SOT23-3]  (value not drawn)
U3  USB to UART 3.3-5V  [QFN_24]  (value not drawn)

### Blocks framed on the sheet
ESP-WROVER-32: C5-C7 MOD1 R12 R13
Peripherals: R14 R15

### Ports
ESP.IO[0..39] (bidir), ESP.RESET (in), I2C (harness I2C), SPI (harness SPI), UART2 (harness UART), USB (harness USB)

### Harnesses
I2C: SDA, SCL
USB: D_p, D_n
SPI: CS, CLK, DO, DI
UART: TXD, RXD

### Nets
3V3_AUX: R14.1 R15.1
3V3_ESP: C6.1 C7.1 D11.1(A) D12.1(A) D13.1(A) MOD1.2(VDD) R12.1 R13.1
3V3_USB: C10.1 C11.2 R16.1 U3.5(VIO) U3.6(VDD)
GND: C5.2 C6.2 C7.2 C8.2 C9.1 C10.2 C11.1 C18.1 MOD1.1(GND) MOD1.15(GND) MOD1.38(GND) MOD1.39(EP-GND) P7.1 R21.2 R22.2 SW1.2 SW3.2 U3.2(GND) U3.25(GND)
VBAT: R17.1
VUSB: C8.1 C9.2 D14.1(A) U3.7(VREGIN) U3.8(VBUS)
BAT.MON: MOD1.7(GPIO35,_ADC1_CH7,_RTC_GPIO5) R17.2 R22.1
CP2102.DTR: T3.1(G) T4.2(S) U3.23(~{DTR})
CP2102.RTS: T3.2(S) T4.1(G) U3.19(~{RTS})
DNU_SPI.CLK: MOD1.20(GPIO6,_SD_CLK,_SPICLK,_HS1_CLK,_U1CTS)
DNU_SPI.CS0: MOD1.19(GPIO11,_SD_CMD,_SPICS0,_HS1_CMD,_U1RTS)
DNU_SPI.D: MOD1.22(GPIO8,_SD_DATA1,_SPID,_HS1_DATA1,_U2CTS)
DNU_SPI.HD: MOD1.17(GPIO9,_SD_DATA2,_SPIHD,_HS1_DATA2,_U1RXD)
DNU_SPI.Q: MOD1.21(GPIO7,_SD_DATA0,_SPIQ,_HS1_DATA0,_U2RTS)
DNU_SPI.WP: MOD1.18(GPIO10,_SD_DATA3,_SPIWP,_HS1_DATA3,_U1TXD)
ESP.BOOT: MOD1.25(GPIO0,_ADC2_CH1,_TOUCH1,_RTC_GPIO11,_CLK_OUT1,_EMAC_TX_CLK) R12.2 SW3.1 T4.3(D)
ESP.IO2: MOD1.24(GPIO2,_ADC2_CH2,_TOUCH2,_RTC_GPIO12,_HSPIWP,_HS2_DATA0,_SD_DATA0)
ESP.IO4: MOD1.26(GPIO4,_ADC2_CH0,_TOUCH0,_RTC_GPIO10,_HSPIHD,_HS2_DATA1,_SD_DATA1,_EMAC_TX_ER)
ESP.IO5: MOD1.29(GPIO5,_VSPICS0,_HS1_DATA6,_EMAC_RX_CLK)
ESP.IO12: MOD1.14(GPIO12,_ADC2_CH5,_TOUCH5,_RTC_GPIO15,_MTDI,_HSPIQ,_HS2_DATA2,_SD_DATA2,_EMAC_TXD3)
ESP.IO13: MOD1.16(GPIO13,_ADC2_CH4,_TOUCH4,_RTC_GPIO14,_MTCK,_HSPID,_HS2_DATA3,_SD_DATA3,_EMAC_RX_ER) R18.2
ESP.IO14: MOD1.13(GPIO14,_ADC2_CH6,_TOUCH6,_RTC_GPIO16,_MTMS,_HSPICLK,_HS2_CLK,_SD_CLK,_EMAC_TXD2)
ESP.IO15: MOD1.23(GPIO15,_ADC2_CH3,_TOUCH3,_MTDO,_HSPICS0,_RTC_GPIO13,_HS2_CMD,_SD_CMD,_EMAC_RXD3)
ESP.IO16: MOD1.27(GPIO16,_HS1_DATA4,_U2RXD,_EMAC_CLK_OUT) ; port UART2.RXD  [also labelled ESP.RXD2]
ESP.IO17: MOD1.28(GPIO17,_HS1_DATA5,_U2TXD,_EMAC_CLK_OUT_180) ; port UART2.TXD  [also labelled ESP.TXD2]
ESP.IO25: MOD1.10(GPIO25,_DAC_1,_ADC2_CH8,_RTC_GPIO6,_EMAC_RXD0)
ESP.IO26: MOD1.11(GPIO26,_DAC_2,_ADC2_CH9,_RTC_GPIO7,_EMAC_RXD1)
ESP.IO27: MOD1.12(GPIO27,_ADC2_CH7,_TOUCH7,_RTC_GPIO17,_EMAC_RX_DV)
ESP.IO32: MOD1.8(GPIO32,_XTAL_32K_P,_ADC1_CH4,_TOUCH9,_RTC_GPIO9)  [project net BUZZER]
ESP.IO33: MOD1.9(GPIO33,_XTAL_32K_N,_ADC1_CH5,_TOUCH8,_RTC_GPIO8)
ESP.IO34: MOD1.6(GPIO34,_ADC1_CH6,_RTC_GPIO4)
ESP.IO36: MOD1.4(GPIO36,_SENSOR_VP,_ADC_H,_ADC1_CH0,_RTC_GPIO0)  [project net ACC.INT1]
ESP.IO39: MOD1.5(GPIO39,_SENSOR_VN,_ADC1_CH3,_ADC_H,_RTC_GPIO3)
ESP.RESET: C5.1 MOD1.3(EN) R13.2 SW1.1 T3.3(D) ; port ESP.RESET
ESP.RXD0: MOD1.34(GPIO3,_U0RXD,_CLK_OUT2) P7.4 R20.2 U3.21(TXD)
ESP.TXD0: MOD1.35(GPIO1,_U0TXD,_CLK_OUT3,_EMAC_RXD2) P7.5 R19.2 U3.20(RXD)
I2C.SCL: MOD1.36(GPIO22,_VSPIWP,_U0RTS,_EMAC_TXD1) R15.2 ; port I2C.SCL
I2C.SDA: MOD1.33(GPIO21,_VSPIHD,_EMAC_TX_EN) R14.2 ; port I2C.SDA
SPI.MISO: MOD1.31(GPIO19,_VSPIQ,_U0CTS,_EMAC_TXD0) ; port SPI.DI  [project net SPI.DI]
SPI.MOSI: MOD1.37(GPIO23,_VSPID,_HS1_STROBE) ; port SPI.DO  [project net SPI.DO]
SPI.SCLK: MOD1.30(GPIO18,_VSPICLK,_HS1_DATA7) ; port SPI.CLK  [project net SPI.CLK]
USB.D_n: U3.4(USBDM) ; port USB.D_n
USB.D_p: U3.3(USBDP) ; port USB.D_p
Vpp: C18.2 U3.16(N.C.)
NetD11_2: D11.2(K) R18.1
NetD12_2: D12.2(K) R19.1
NetD13_2: D13.2(K) R20.1
NetD14_2: D14.2(K) R21.1
NetR16_2: R16.2 U3.9(~{RST})

Not connected (* = marked no-connect by the designer): MOD1 32(NC)*; P7 2 3 6; U3 1(RI/CLK)* 10(N.C.)* 11(GPIO0.3/WAKEUP)* 12(GPIO0.2/RS485)* 13(GPIO0.1/RXT)* 14(GPIO0.0/TXT)* 15(~{SUSPEND})* 17(SUSPEND)* 18(~{CTS})* 22(~{DSR})* 24(~{DCD})*

### Buses and harness runs
bus ESP.IO[0..39] = port ESP.IO[0..39]
harness I2C = port I2C
harness SPI = port SPI
harness USB = port USB

### Layout directives
net class POWER: 3V3_USB

### Notes on the sheet
- >
- <
- BOOT
- U0TXD
- ESP.DOWNLOAD
- (near MOD1) SPICLK
- U0RXD
- GPIO2
- (near MOD1) GPIO4
- (near MOD1) GPIO5
- LCD CS0
- Badge Link
- WS2812
- (near MOD1) SPIQ
- (near MOD1) SPID
- (near MOD1) SPIHD
- (near MOD1) SPIWP
- (near MOD1) SPICS0
- Combined with internal flash
- (near MOD1) U2RXD
- (near MOD1) GPIO12
- (near MOD1) GPIO13
- (near MOD1) GPIO14
- (near MOD1) GPIO15
- SaO IO1
- SaO IO2
- LCD CS1
- MTDI do not pull high, internal pull-down
- MTDO, internal pull-up
- (near MOD1) SDA
- (near MOD1) SCL
- (near MOD1) VSPICLK
- (near MOD1) VSPIQ
- (near MOD1) U2TXD
- SD CS
- (near MOD1) VSPID
- (near MOD1) GPIO25
- (near MOD1) GPIO26
- (near MOD1) GPIO27
- (near MOD1) GPIO32
- Buzzer
- IR In
- (near MOD1) GPIO34
- (near MOD1) GPIO35
- (near MOD1) GPIO36
- (near MOD1) GPIO39
- (near MOD1) GPIO33
- Privacy
- Acc Int
- LCD DC
- Input only
- USB Interface
- USB UART
- (near U3) CP2102N or CP2104
- Title
- Revision
- Date
- Dranw By
- Size
- A3
- Sheet
- of
- (in symbol CP2102N # QFN24 USB UART) CP2102N

### Library data of the parts
C5 C6 C8 C10 = CAP # 100nF 16V 0603: Capacitor Ceramic
C7 C9 C11 C18 = CAP # 10uF 10V 0805: Capacitor Ceramic; Supplier 1: Farnell; Supplier Part Number 1: 2320859
D11 D12 = LED # Red 0805: =Description; Supplier 1: Farnell; Supplier Part Number 1: 2099236
D13 = LED # Green 0805: =Description; Supplier 1: Farnell; Supplier Part Number 1: 2099239
D14 = LED # Blue 0805: =Description; Supplier 1: Farnell; Supplier Part Number 1: 2217980
MOD1 = WiFi # MOD ESP-WROVER-32: Value: ESP-WROVER-32; Supplier 1: Espressif; Supplier Part Number 1: ESP-WROVER-32
P7 = Pin Header 2.54mm 6way
R12-R15 = RES # 5K1 0603: Supplier 1: Farnell; Supplier Part Number 1: 2845922
R16 R18-R21 = RES # 1K2 0603
R17 R22 = RES # 100K 0603
SW1 SW3 = SW # TACT small 4.5x4.5mm SMD WS-TASV
T3 T4 = BSS138 N-Ch MOSFET 0.2A 3.2Vgs 60Vds: Value: BSS138; Supplier 1: Farnell; Supplier Part Number 1: 2432717
U3 = CP2102N # QFN24 USB UART: =Description; Value: CP2102N-A01-GQFN24; Supplier 1: Farnell; Supplier Part Number 1: 2577278; Supplier 2: Digikey; Supplier Part Number 2: 336-3693-ND

## Nets that join several sheets
3V3_AUX: Fri3D_2020_00 (7 pins), Fri3D_2020_Peripherals (22 pins), Fri3D_2020_Power (C15.1 U5.5), Fri3D_2020_ESP32 (R14.1 R15.1)
3V3_ESP: Fri3D_2020_Power (C13.1 U4.5), Fri3D_2020_ESP32 (8 pins)
GND: Fri3D_2020_00 (21 pins), Fri3D_2020_Peripherals (34 pins), Fri3D_2020_Power (18 pins), Fri3D_2020_ESP32 (19 pins)
VBAT: Fri3D_2020_00 (P4.12), Fri3D_2020_Peripherals (C26.1 U9.6), Fri3D_2020_Power (6 pins), Fri3D_2020_ESP32 (R17.1)
VSYS: Fri3D_2020_00 (J1.1 P9.8), Fri3D_2020_Peripherals (5 pins), Fri3D_2020_Power (7 pins)
VUSB: Fri3D_2020_00 (6 pins), Fri3D_2020_Power (7 pins), Fri3D_2020_ESP32 (5 pins)
ACC.INT1: Fri3D_2020_00 (P5.8), Fri3D_2020_Peripherals (R6.2 SW9.6 U2.12), Fri3D_2020_ESP32 (MOD1.4)
BUZZER: Fri3D_2020_00 (P4.4 P9.10), Fri3D_2020_Peripherals (R11.1 SW9.5 T2.1), Fri3D_2020_ESP32 (MOD1.8)
ESP.IO2: Fri3D_2020_Peripherals (D2.4), Fri3D_2020_ESP32 (MOD1.24)
ESP.IO4: Fri3D_2020_00 (P5.7 R2.2 R3.1), Fri3D_2020_ESP32 (MOD1.26)
ESP.IO5: Fri3D_2020_Peripherals (P8.9), Fri3D_2020_ESP32 (MOD1.29)
ESP.IO12: Fri3D_2020_00 (P4.8), Fri3D_2020_Peripherals (SW5.2), Fri3D_2020_ESP32 (MOD1.14)
ESP.IO13: Fri3D_2020_00 (P2.6 P4.9 TP2.1), Fri3D_2020_Peripherals (SW8.1), Fri3D_2020_ESP32 (MOD1.16 R18.2)
ESP.IO14: Fri3D_2020_00 (P3.6 P4.3 P9.2 TP3.1), Fri3D_2020_ESP32 (MOD1.13)
ESP.IO15: Fri3D_2020_00 (P4.5 P9.4), Fri3D_2020_ESP32 (MOD1.23)
ESP.IO16: Fri3D_2020_00 (P5.3), Fri3D_2020_Peripherals (SW9.1), Fri3D_2020_ESP32 (MOD1.27)
ESP.IO17: Fri3D_2020_00 (P5.2), Fri3D_2020_Peripherals (SW9.2), Fri3D_2020_ESP32 (MOD1.28)
ESP.IO25: Fri3D_2020_00 (P5.11), Fri3D_2020_Peripherals (C22.2), Fri3D_2020_ESP32 (MOD1.10)
ESP.IO26: Fri3D_2020_00 (P5.12), Fri3D_2020_Peripherals (C23.2), Fri3D_2020_ESP32 (MOD1.11)
ESP.IO27: Fri3D_2020_00 (P4.7), Fri3D_2020_Peripherals (D6.1 SW7.1), Fri3D_2020_ESP32 (MOD1.12)
ESP.IO33: Fri3D_2020_00 (P4.6 P9.12), Fri3D_2020_Peripherals (P8.11), Fri3D_2020_ESP32 (MOD1.9)
ESP.IO34: Fri3D_2020_00 (P5.10), Fri3D_2020_Peripherals (SW9.3), Fri3D_2020_ESP32 (MOD1.6)
ESP.IO39: Fri3D_2020_00 (P1.2 P5.9 R1.2), Fri3D_2020_Peripherals (SW6.1), Fri3D_2020_ESP32 (MOD1.5)
ESP.RESET: Fri3D_2020_00 (P5.16), Fri3D_2020_Peripherals (P8.8), Fri3D_2020_ESP32 (5 pins)
I2C.SCL: Fri3D_2020_00 (P2.4 P3.4 P4.2 P9.1), Fri3D_2020_Peripherals (U1.6 U2.1 U7.3), Fri3D_2020_ESP32 (MOD1.36 R15.2)
I2C.SDA: Fri3D_2020_00 (P2.3 P3.3 P4.1 P9.3), Fri3D_2020_Peripherals (U1.5 U2.4 U7.2), Fri3D_2020_ESP32 (MOD1.33 R14.2)
LED.DOUT: Fri3D_2020_00 (P2.5 P3.5), Fri3D_2020_Peripherals (D5.2)
PWR.EN: Fri3D_2020_00 (P4.11), Fri3D_2020_Power (SW2.2 U4.3 U5.3)
SPI.CLK: Fri3D_2020_00 (P5.6), Fri3D_2020_Peripherals (P8.10), Fri3D_2020_ESP32 (MOD1.30)
SPI.DI: Fri3D_2020_00 (P5.4), Fri3D_2020_ESP32 (MOD1.31)
SPI.DO: Fri3D_2020_00 (P5.5), Fri3D_2020_Peripherals (P8.12), Fri3D_2020_ESP32 (MOD1.37)
USB.D_n: Fri3D_2020_00 (D1.1 J2.A7 J2.B7), Fri3D_2020_ESP32 (U3.4)
USB.D_p: Fri3D_2020_00 (D1.6 J2.A6 J2.B6), Fri3D_2020_ESP32 (U3.3)

## Assembly variants
Default: not fitted D1 D7 D8 D9 D10 J1 P1 P2 P3 P4 P5 P6 P7 P9 P10 R27 TP1 TP2 TP3 TP4 TP5 TP6 TP7 TP8 TP9 TP10 U1